# EAGLE design Brushless_2015RevA1_OptEnc (EAGLE 6.2)

## Sheet 1 of 3
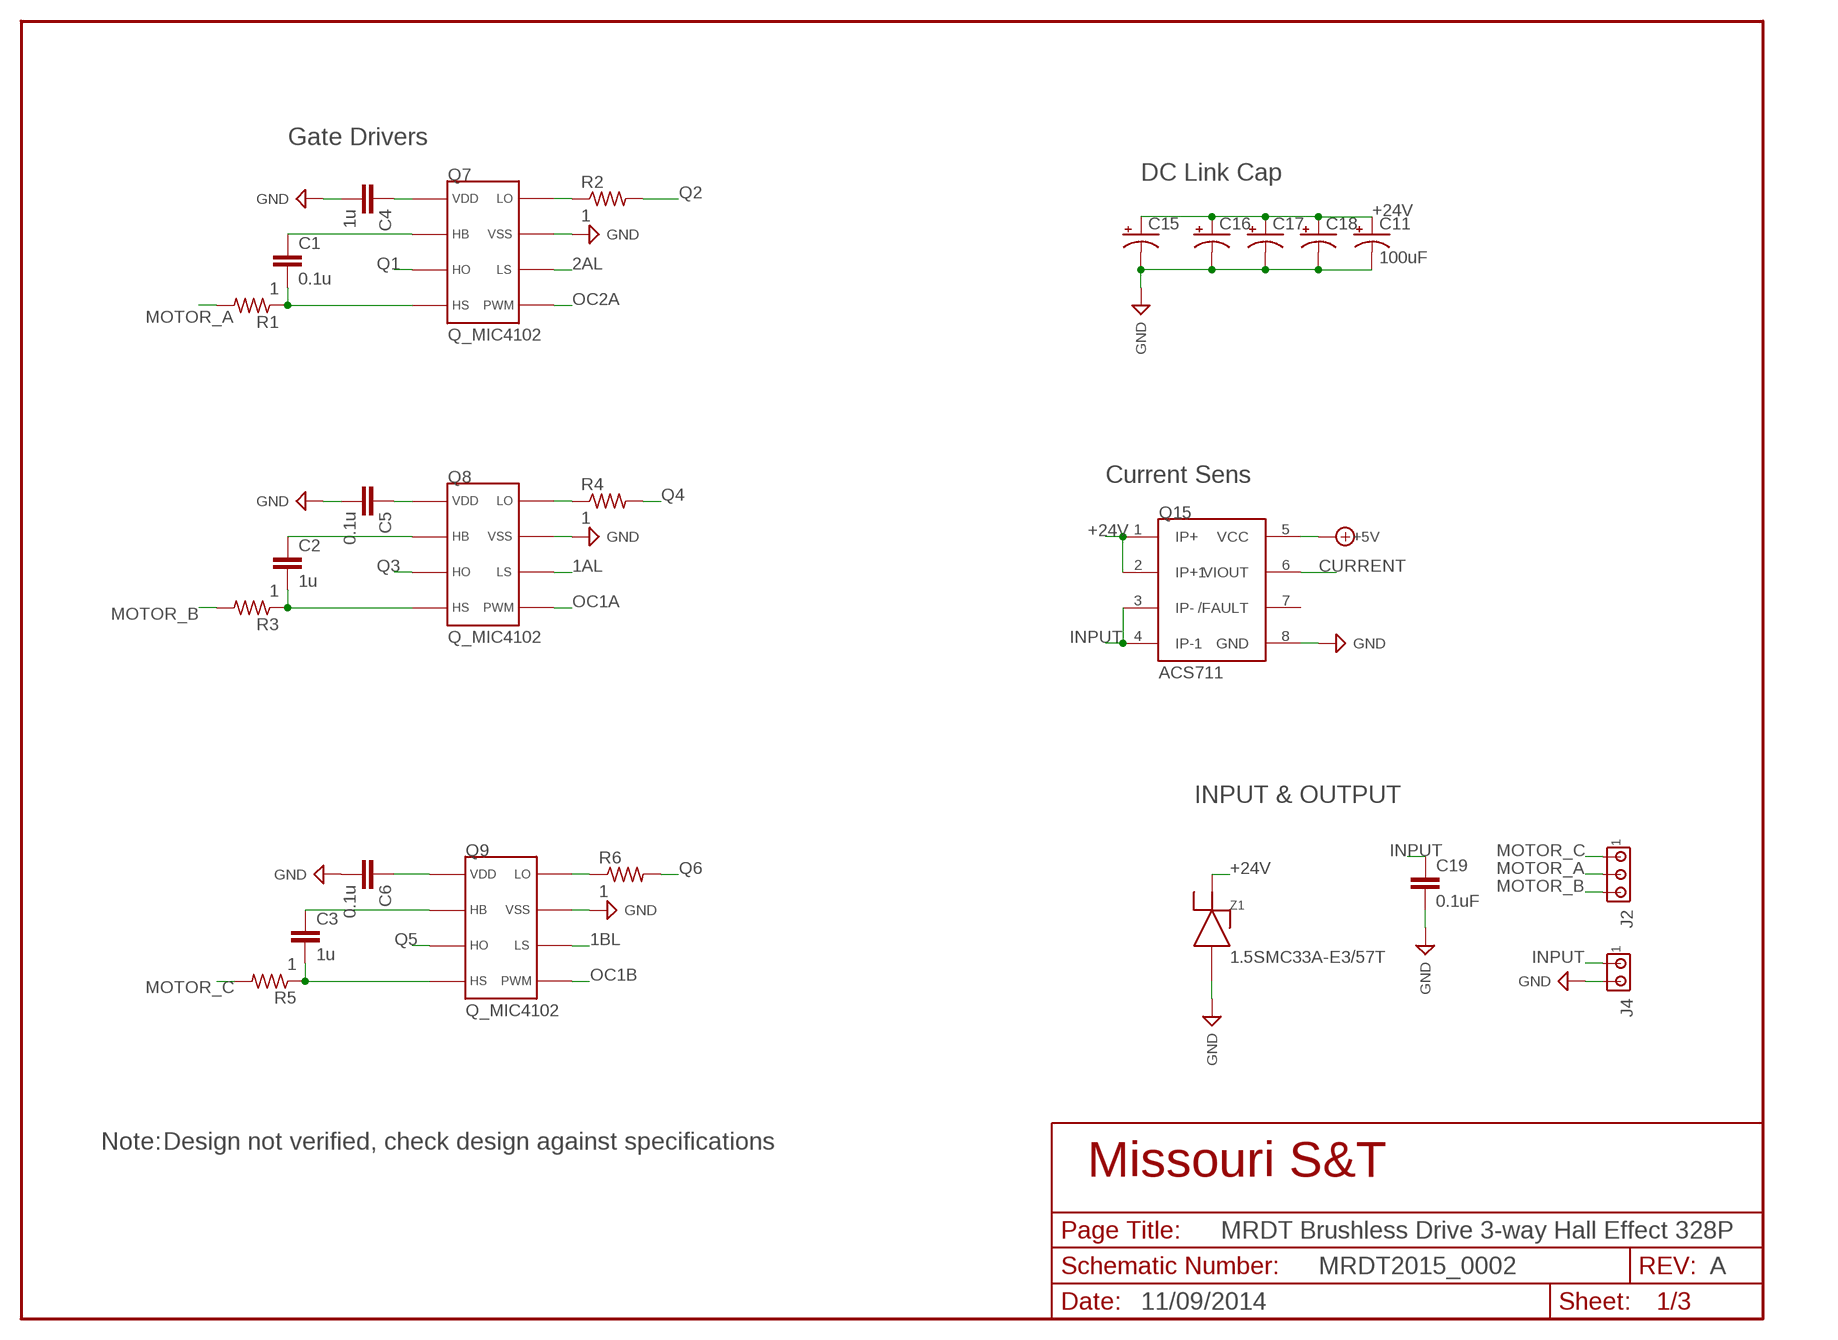
[diagram p0: schematic, sheet 1]

### Parts
C1  0.1u  C_CAP_1206  [C_1206]
C2  1u  C_CAP_1206  [C_1206]
C3  1u  C_CAP_1206  [C_1206]
C4  1u  C_CAP_1206  [C_1206]
C5  0.1u  C_CAP_1206  [C_1206]
C6  0.1u  C_CAP_1206  [C_1206]
C11  100uF  CAP_POL8MM  [C_8MM]
C15  CAP_POL8MM  [C_8MM]
C16  CAP_POL8MM  [C_8MM]
C17  CAP_POL8MM  [C_8MM]
C18  CAP_POL8MM  [C_8MM]
C19  0.1uF  C_CAP_1206  [C_1206]
J2  J_MTA3P_156  [J_MTA156_3P]
J4  J_HDR1X2_MTA_156MIL  [J_MTA1X2_156MIL]
Q7  Q_MIC4102  [SOIC8]
Q8  Q_MIC4102  [SOIC8]
Q9  Q_MIC4102  [SOIC8]
Q15  ACS711  ACS711SOIC  [SOIC8]
R1  1  R_RES_0805  [R_0805]
R2  1  R_RES_0805  [R_0805]
R3  1  R_RES_0805  [R_0805]
R4  1  R_RES_0805  [R_0805]
R5  1  R_RES_0805  [R_0805]
R6  1  R_RES_0805  [R_0805]
Z1  Z_TVSDO214  [DO-214AC]

### Nets
1AL: Q8.6(LS) ; also sheet 2
1BL: Q9.6(LS) ; also sheet 2
2AL: Q7.6(LS) ; also sheet 2
+5V: Q15.5(VCC) ; supply symbol labelled SUP_+5V ; also sheet 2
+12V: C4.1 C5.1 C6.1 Q7.1(VDD) Q8.1(VDD) Q9.1(VDD) ; also sheet 2
+24V: C11.+ C15.+ C16.+ C17.+ C18.+ Q15.1(IP+) Q15.2(IP+1) Z1.C ; also sheet 2,3
CURRENT: Q15.6(VIOUT) ; also sheet 2
GND: C4.2 C5.2 C6.2 C11.- C15.- C16.- C17.- C18.- C19.2 J4.2 Q7.7(VSS) Q8.7(VSS) Q9.7(VSS) Q15.8(GND) Z1.A ; supply symbol labelled SUP_GND ; also sheet 2,3
INPUT: C19.1 J4.1 Q15.3(IP-) Q15.4(IP-1)
MOTOR_A: J2.2 R1.2 ; also sheet 3
MOTOR_B: J2.3 R3.2 ; also sheet 3
MOTOR_C: J2.1 R5.2 ; also sheet 3
N$1: Q7.8(LO) R2.1
N$2: Q8.8(LO) R4.1
N$3: Q9.8(LO) R6.1
N$4: C3.1 Q9.2(HB)
N$5: C3.2 Q9.4(HS) R5.1
N$6: C2.1 Q8.2(HB)
N$8: C2.2 Q8.4(HS) R3.1
N$9: C1.1 Q7.2(HB)
N$10: C1.2 Q7.4(HS) R1.1
OC1A: Q8.5(PWM) ; also sheet 2
OC1B: Q9.5(PWM) ; also sheet 2
OC2A: Q7.5(PWM) ; also sheet 2
Q1: Q7.3(HO) ; also sheet 3
Q2: R2.2 ; also sheet 3
Q3: Q8.3(HO) ; also sheet 3
Q4: R4.2 ; also sheet 3
Q5: Q9.3(HO) ; also sheet 3
Q6: R6.2 ; also sheet 3
Unconnected: Q15.7(/FAULT)

### Notes on the sheet
- Gate Drivers
- DC Link Cap
- Current Sens
- INPUT & OUTPUT
- 1.5SMC33A-E3/57T
- Note: | Design not verified, check design against specifications
- MRDT Brushless Drive 3-way Hall Effect 328P
- MRDT2015_0002 | A
- 11/09/2014

## Sheet 2 of 3
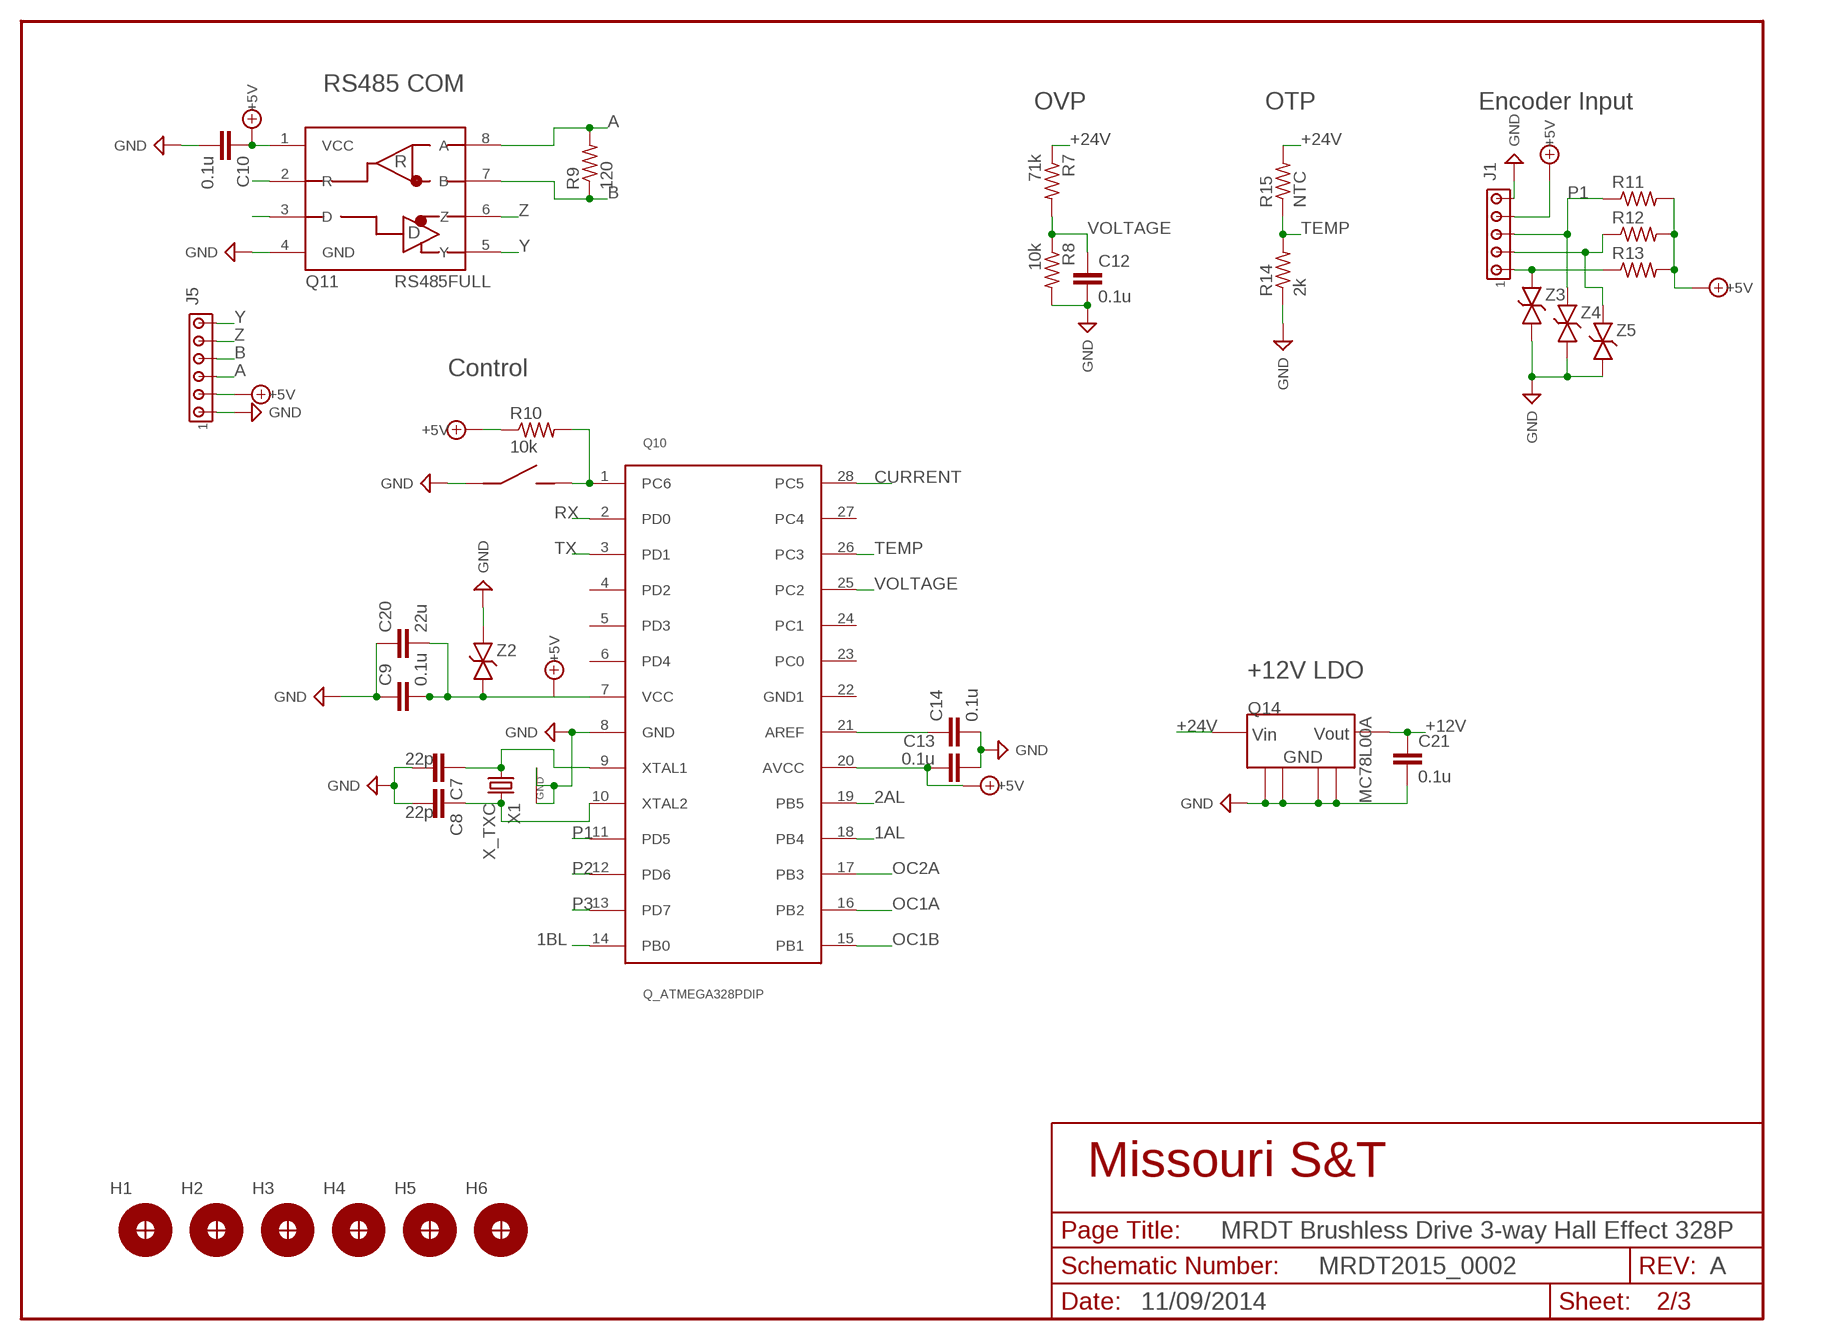
[diagram p1: schematic, sheet 2]

### Parts
C7  22p  C_CAP_1206  [C_1206]
C8  22p  C_CAP_1206  [C_1206]
C9  0.1u  C_CAP_0805  [C_0805]
C10  0.1u  C_CAP_0805  [C_0805]
C12  0.1u  C_CAP_0805  [C_0805]
C13  0.1u  C_CAP_0805  [C_0805]
C14  0.1u  C_CAP_0805  [C_0805]
C20  22u  C_CAP_1206  [C_1206]
C21  0.1u  C_CAP_0805  [C_0805]
H1  H_MNTHOLE_#4  [H_MNTHOLE_#4]
H2  H_MNTHOLE_#4  [H_MNTHOLE_#4]
H3  H_MNTHOLE_#4  [H_MNTHOLE_#4]
H4  H_MNTHOLE_#4  [H_MNTHOLE_#4]
H5  H_MNTHOLE_#4  [H_MNTHOLE_#4]
H6  H_MNTHOLE_#4  [H_MNTHOLE_#4]
J1  J_MTA5P_100  [J_MTA100_5P]
J3  J_MC32857  [J_TOGGLE]
J5  J_HDR1X6_MTA_100MIL  [J_MTA1X6_100MIL]
Q10  Q_ATMEGA328PDIP  [DIP28]
Q11  RS485FULL  [SOIC8]
Q14  MC78L00A  Q_LDOSOIC  [SOIC8]
R7  71k  R_RES_0805  [R_0805]
R8  10k  R_RES_0805  [R_0805]
R9  120  R_RES_0805  [R_0805]
R10  10k  R_RES_0805  [R_0805]
R11  R_RES_1206  [R_1206]
R12  R_RES_1206  [R_1206]
R13  R_RES_1206  [R_1206]
R14  2k  R_RES_0805  [R_0805]
R15  NTC  R_RES_0805  [R_0805]
X1  X_TXC  [SMD_CRYSTAL]
Z2  Z_ESD0603  [0603]
Z3  Z_ESD0603  [0603]
Z4  Z_ESD0603  [0603]
Z5  Z_ESD0603  [0603]

### Nets
1AL: Q10.18(PB4) ; also sheet 1
1BL: Q10.14(PB0) ; also sheet 1
2AL: Q10.19(PB5) ; also sheet 1
+5V: C9.2 C10.1 C13.1 C20.2 J1.4 J5.2 Q10.7(VCC) Q10.20(AVCC) Q11.1(VCC) R10.1 R11.2 R12.2 R13.2 Z2.1 ; supply symbol labelled SUP_+5V ; also sheet 1
+12V: C21.1 Q14.1(VOUT) ; also sheet 1
+24V: Q14.8(VIN) R7.1 R15.2 ; also sheet 1,3
A: J5.3 Q11.8(A) R9.2
B: J5.4 Q11.7(B) R9.1
CURRENT: Q10.28(PC5) ; also sheet 1
GND: C7.2 C8.2 C9.1 C10.2 C12.2 C13.2 C14.2 C20.1 C21.2 J1.5 J3.P$1 J5.1 Q10.8(GND) Q11.4(GND) Q14.2(GND) Q14.3(GND1) Q14.6(GND3) Q14.7(GND2) R8.2 R14.1 X1.2(GND1) X1.4(GND2) Z2.2 Z3.1 Z4.1 Z5.1 ; supply symbol labelled SUP_GND ; also sheet 1,3
N$7: J3.P$2 Q10.1(PC6) R10.2
N$11: C7.1 Q10.9(XTAL1) X1.1
N$13: C8.1 Q10.10(XTAL2) X1.3
N$15: C14.1 Q10.21(AREF)
OC1A: Q10.16(PB2) ; also sheet 1
OC1B: Q10.15(PB1) ; also sheet 1
OC2A: Q10.17(PB3) ; also sheet 1
P1: J1.3 Q10.11(PD5) R11.1 Z4.2
P2: J1.2 Q10.12(PD6) R12.1 Z5.2
P3: J1.1 Q10.13(PD7) R13.1 Z3.2
RX: Q10.2(PD0) Q11.2(R)
TEMP: Q10.26(PC3) R14.2 R15.1
TX: Q10.3(PD1) Q11.3(D)
VOLTAGE: C12.1 Q10.25(PC2) R7.2 R8.1
Y: J5.6 Q11.5(Y)
Z: J5.5 Q11.6(Z)
Unconnected: H1.1 H2.1 H3.1 H4.1 H5.1 H6.1 Q10.4(PD2) Q10.5(PD3) Q10.6(PD4) Q10.22(GND1) Q10.23(PC0) Q10.24(PC1) Q10.27(PC4)

### Notes on the sheet
- RS485 COM
- OVP | OTP | Encoder Input
- Control
- +12V LDO
- MRDT Brushless Drive 3-way Hall Effect 328P
- MRDT2015_0002 | A
- 11/09/2014

## Sheet 3 of 3
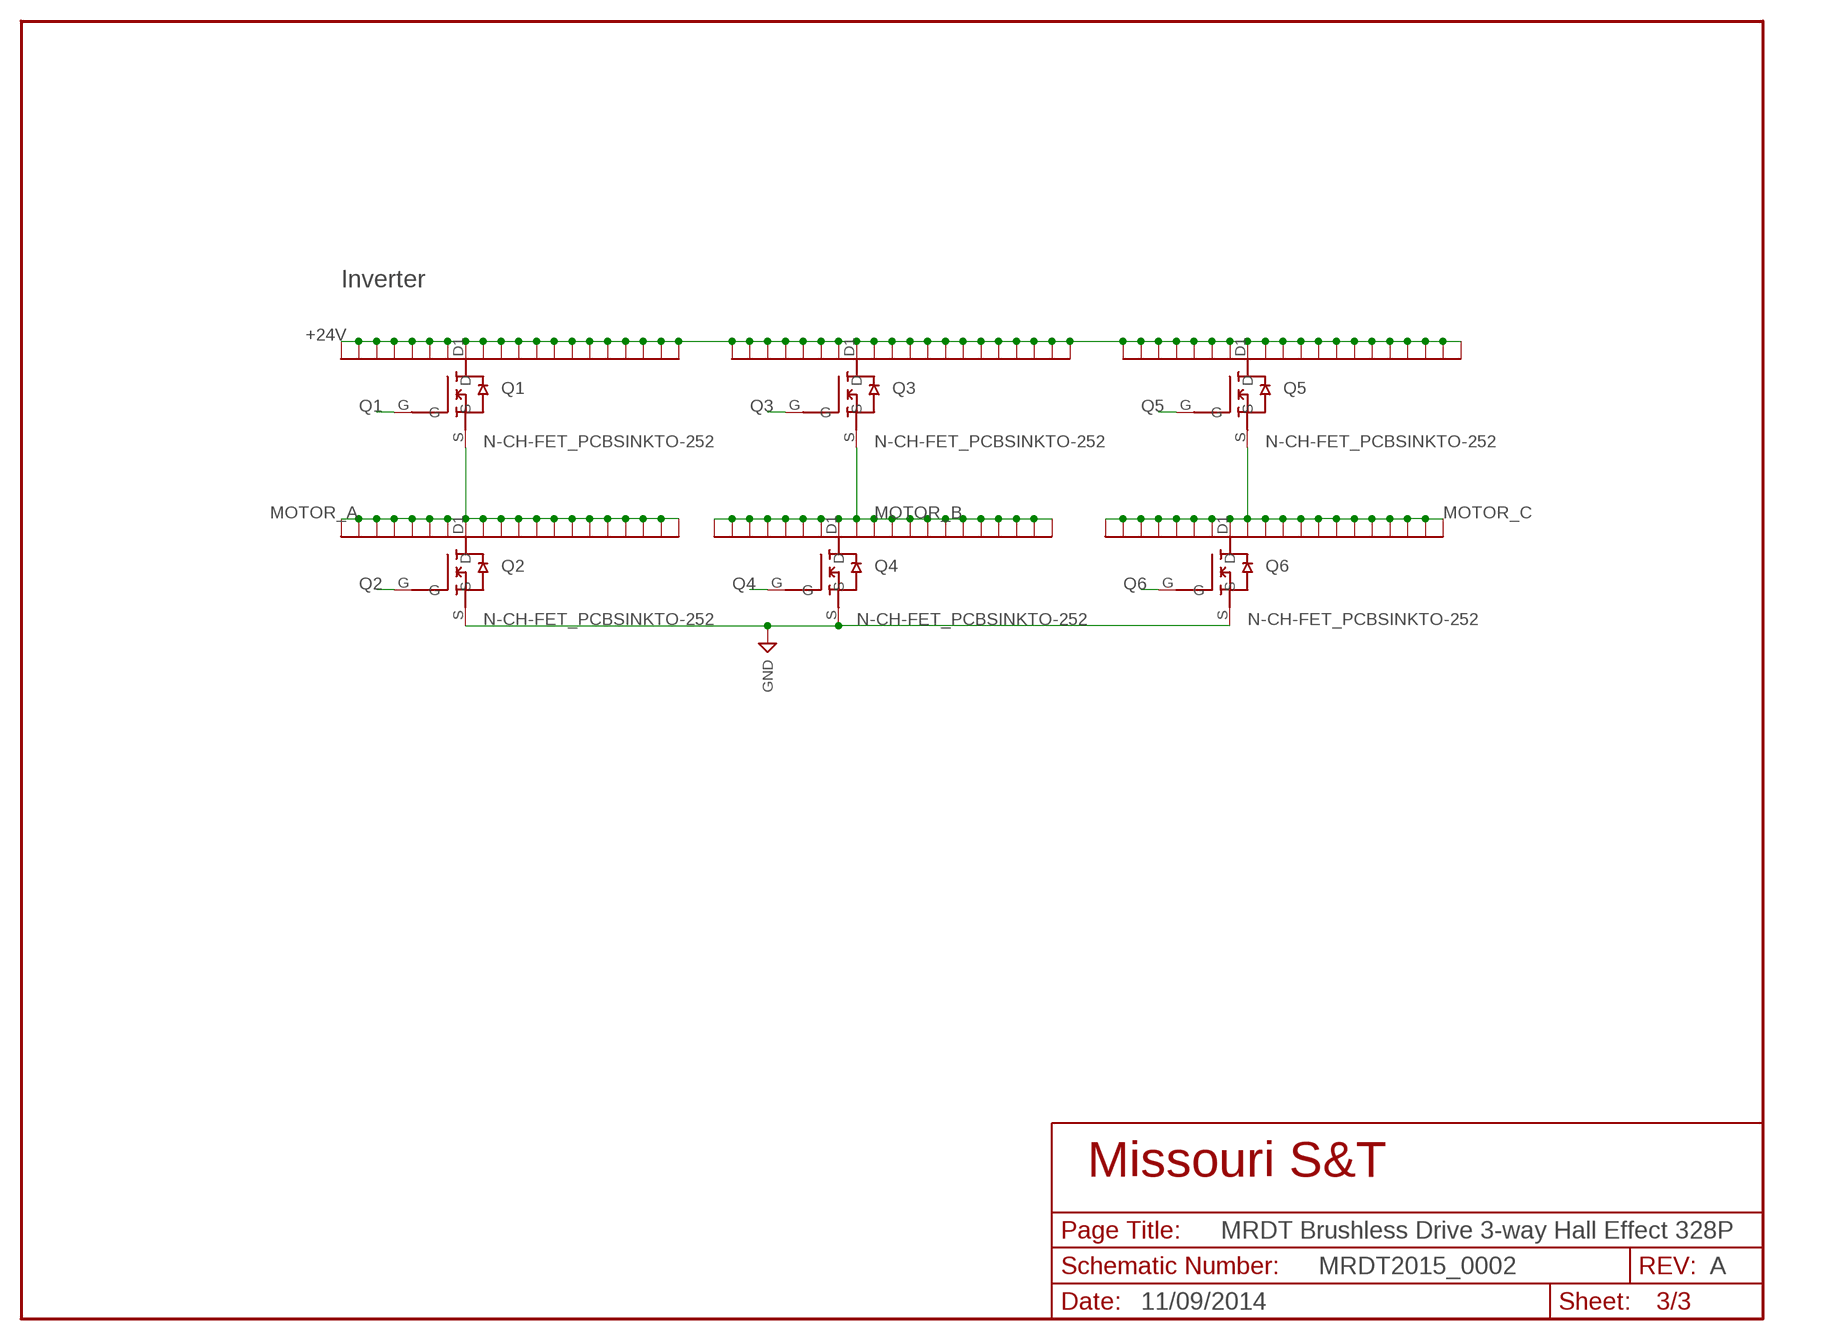
[diagram p2: schematic, sheet 3]

### Parts
Q1  N-CH-FET_PCBSINKTO-252  [TO-252-SINK]
Q2  N-CH-FET_PCBSINKTO-252  [TO-252-SINK]
Q3  N-CH-FET_PCBSINKTO-252  [TO-252-SINK]
Q4  N-CH-FET_PCBSINKTO-252  [TO-252-SINK]
Q5  N-CH-FET_PCBSINKTO-252  [TO-252-SINK]
Q6  N-CH-FET_PCBSINKTO-252  [TO-252-SINK]

### Nets
+24V: Q1.D1(D) Q1.D2 Q1.D3 Q1.D4 Q1.D5 Q1.D6 Q1.D7 Q1.D8 Q1.D9 Q1.D10 Q1.D11 Q1.D12 Q1.D13 Q1.D14 Q1.D15 Q1.D16 Q1.D17 Q1.D18 Q1.D19 Q1.D20 Q3.D1(D) Q3.D2 Q3.D3 Q3.D4 Q3.D5 Q3.D6 Q3.D7 Q3.D8 Q3.D9 Q3.D10 Q3.D11 Q3.D12 Q3.D13 Q3.D14 Q3.D15 Q3.D16 Q3.D17 Q3.D18 Q3.D19 Q3.D20 Q5.D1(D) Q5.D2 Q5.D3 Q5.D4 Q5.D5 Q5.D6 Q5.D7 Q5.D8 Q5.D9 Q5.D10 Q5.D11 Q5.D12 Q5.D13 Q5.D14 Q5.D15 Q5.D16 Q5.D17 Q5.D18 Q5.D19 Q5.D20 ; also sheet 1,2
GND: Q2.S Q4.S Q6.S ; supply symbol labelled SUP_GND ; also sheet 1,2
MOTOR_A: Q1.S Q2.D1(D) Q2.D2 Q2.D3 Q2.D4 Q2.D5 Q2.D6 Q2.D7 Q2.D8 Q2.D9 Q2.D10 Q2.D11 Q2.D12 Q2.D13 Q2.D14 Q2.D15 Q2.D16 Q2.D17 Q2.D18 Q2.D19 Q2.D20 ; also sheet 1
MOTOR_B: Q3.S Q4.D1(D) Q4.D2 Q4.D3 Q4.D4 Q4.D5 Q4.D6 Q4.D7 Q4.D8 Q4.D9 Q4.D10 Q4.D11 Q4.D12 Q4.D13 Q4.D14 Q4.D15 Q4.D16 Q4.D17 Q4.D18 Q4.D19 Q4.D20 ; also sheet 1
MOTOR_C: Q5.S Q6.D1(D) Q6.D2 Q6.D3 Q6.D4 Q6.D5 Q6.D6 Q6.D7 Q6.D8 Q6.D9 Q6.D10 Q6.D11 Q6.D12 Q6.D13 Q6.D14 Q6.D15 Q6.D16 Q6.D17 Q6.D18 Q6.D19 Q6.D20 ; also sheet 1
Q1: Q1.G ; also sheet 1
Q2: Q2.G ; also sheet 1
Q3: Q3.G ; also sheet 1
Q4: Q4.G ; also sheet 1
Q5: Q5.G ; also sheet 1
Q6: Q6.G ; also sheet 1

### Notes on the sheet
- Inverter
- MRDT Brushless Drive 3-way Hall Effect 328P
- MRDT2015_0002 | A
- 11/09/2014

## Library data of the parts
C1-C10 C12-C14 C21 = Master:C_CAP
C11 C15-C18 = Master:CAP_POL: Generic Polarized Capacitor
C19 C20 = Lib_Passive:C_CAP
H1-H6 = Lib_TH:H_MNTHOLE
J1 = Lib_TH:J_MTA5P
J2 = Lib_TH:J_MTA3P
J3 = Master:J_MC32857: SWITCH, TACTILE, SPST-NO, 50mA, THD
J4 = Lib_Electromechanical:J_HDR1X2
J5 = Lib_Electromechanical:J_HDR1X6: AMP connector
Q1-Q6 = Master:N-CH-FET_PCBSINK
Q7-Q9 = Master:Q_MIC4102
Q10 = Master:Q_ATMEGA328P: ATMEGA 328P
Q11 = Master:RS485FULL: Generic Full-Duplex RS485 Transciever, compatible with ADM485x series and MAX308x
Q14 = Master:Q_LDOSOIC
Q15 = Master:ACS711: Hall Effect Current Sensor
R1-R9 = Master:R_RES
R10-R15 = Lib_Passive:R_RES
X1 = Master:X_TXC
Z1 = Master:Z_TVS: Generic TVS Diode
Z2-Z5 = Master:Z_ESD

## Board
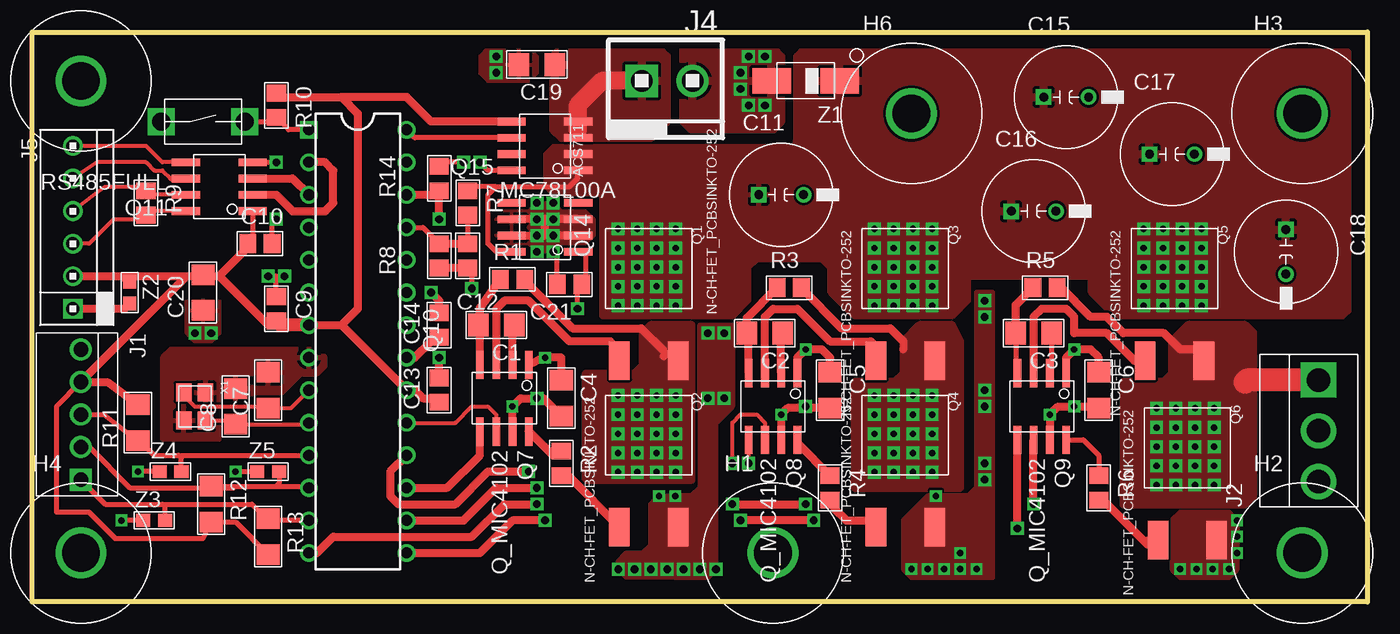
[diagram p3: board, top side]
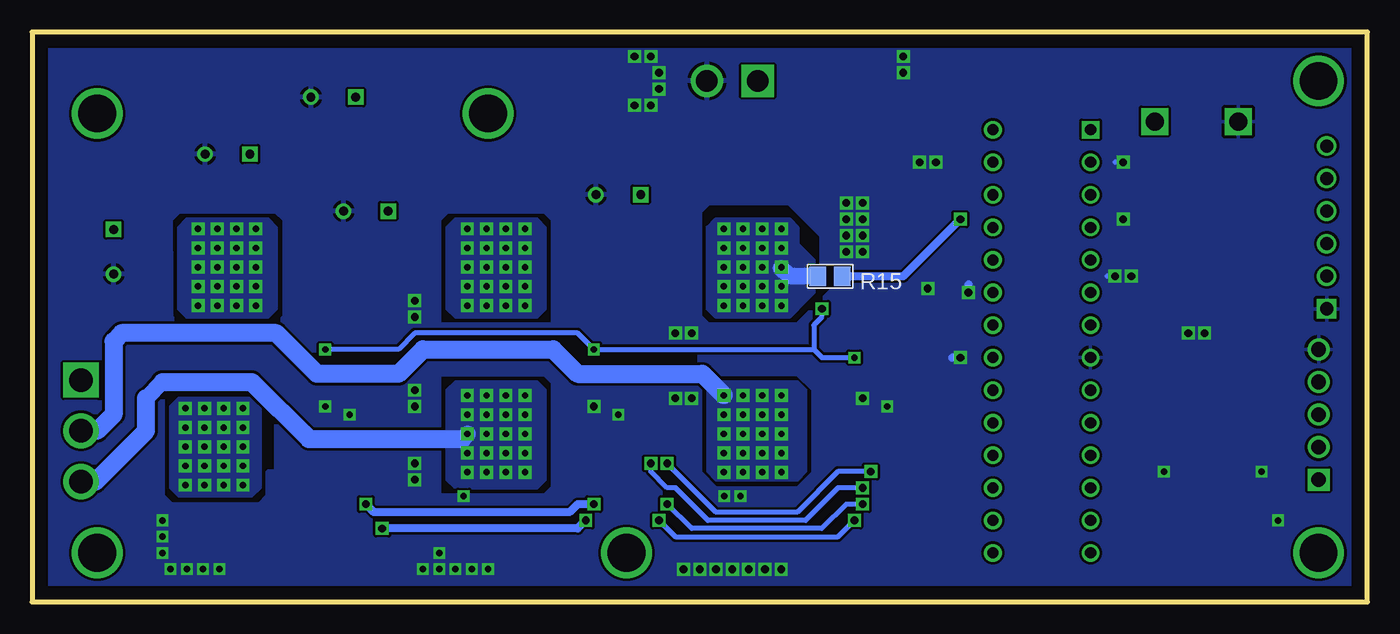
[diagram p4: board, bottom side, seen from below]

Size 104.14 x 44.45 mm. Coordinates in mm from the lower left corner, seen from the top.
Outline: 0,0 0,44.45 104.14,44.45 104.14,0 0,0
Copper layers (1*16): Top 0.035mm / dielectric 1.5mm / Bottom 0.035mm
Design rules: minimum track width 10mil, minimum drill 15mil, track to track 8mil, track to pad 8mil, pad to pad 8mil, via to via 8mil, smd to smd 8mil, copper to edge 40mil, drill to drill 8mil, minimum pad ring 10mil, minimum via ring 8mil, stop-mask expansion 0mil, vias tented up to drill 0mil, thermal gap 10mil

### Footprints (pad centres in the part's own frame; a part is rotated, then mirrored left to right if it is on the bottom)
C_1206 = smd 1.6 x 1.8: 1 -1.4,0; 2 1.4,0
C_0805 = smd 1.3 x 1.5: 1 -0.95,0; 2 0.95,0
C_8MM = drill 0.7 square: + -1.75,0 | drill 0.7: - 1.75,0
H_MNTHOLE_#4 = drill 2.946: 1 0,0
J_MTA100_5P = drill 1.143 square: 1 5.08,0 | drill 1.143: 2 2.54,0; 3 0,0; 4 -2.54,0; 5 -5.08,0
J_MTA156_3P = drill 1.829 square: 1 3.962,0 | drill 1.829: 2 0,0; 3 -3.962,0
J_TOGGLE = drill 1.4 square: P$1 -3.25,0; P$2 3.25,0
J_MTA1X2_156MIL = drill 1.676 square: 1 1.981,0 | drill 1.676: 2 -1.981,0
J_MTA1X6_100MIL = drill 1.016 square: 1 6.35,0 | drill 1.016: 2 3.81,0; 3 1.27,0; 4 -1.27,0; 5 -3.81,0; 6 -6.35,0
TO-252-SINK = drill 0.5 square: D1 -3.1,2.1; D2 -3.1,0.6; D3 -3.1,-0.9; D4 -3.1,-2.4; D5 -1.6,-2.4; D6 -1.6,-0.9; D7 -1.6,0.6; D8 -1.6,2.1; D9 -0.1,2.1; D10 -0.1,0.6; D11 -0.1,-0.9; D12 -0.1,-2.4; D13 1.4,-2.4; D14 1.4,-0.9; D15 1.4,0.6; D16 1.4,2.1; D17 2.9,-2.4; D18 2.9,-0.9; D19 2.9,0.6; D20 2.9,2.1 | smd 3 x 1.6: G 7.18,-2.285; S 7.18,2.285
SOIC8 = smd 2.2 x 0.6: 1 -2.6,1.905; 2 -2.6,0.635; 3 -2.6,-0.635; 4 -2.6,-1.905; 5 2.6,-1.905; 6 2.6,-0.635; 7 2.6,0.635; 8 2.6,1.905
DIP28 = drill 0.864 square: 1 -16.51,-3.81 | drill 0.864: 2 -13.97,-3.81; 3 -11.43,-3.81; 4 -8.89,-3.81; 5 -6.35,-3.81; 6 -3.81,-3.81; 7 -1.27,-3.81; 8 1.27,-3.81; 9 3.81,-3.81; 10 6.35,-3.81; 11 8.89,-3.81; 12 11.43,-3.81; 13 13.97,-3.81; 14 16.51,-3.81; 15 16.51,3.81; 16 13.97,3.81; 17 11.43,3.81; 18 8.89,3.81; 19 6.35,3.81; 20 3.81,3.81; 21 1.27,3.81; 22 -1.27,3.81; 23 -3.81,3.81; 24 -6.35,3.81; 25 -8.89,3.81; 26 -11.43,3.81; 27 -13.97,3.81; 28 -16.51,3.81
R_0805 = smd 1.3 x 1.5: 1 -0.95,0; 2 0.95,0
R_1206 = smd 1.6 x 1.8: 1 -1.4,0; 2 1.4,0
SMD_CRYSTAL = smd 1.4 x 1.2: 1 -1.1,-0.865; 2 1.1,-0.865; 3 1.1,0.835; 4 -1.1,0.835
DO-214AC = smd 3 x 2: A 2.65,0; C -2.65,0
0603 = smd 1.1 x 1: 1 -0.85,0; 2 0.85,0

### Placement (x,y rotation side)
C1  36.2,21.59 180 top
C2  57.15,20.95 180 top
C3  78.11,20.95 180 top
C4  41.27,15.88 270 top
C5  62.23,16.51 270 top
C6  83.19,16.51 270 top
C7  18.41,16.51 90 top
C8  15.88,15.24 90 top
C9  19.05,22.86 270 top
C10  17.78,27.94 0 top
C11  58.42,31.75 0 top
C12  33.97,26.99 270 top
C13  31.75,16.51 90 top
C14  31.75,21.59 90 top
C15  80.64,39.37 0 top
C16  78.11,30.48 0 top
C17  88.9,34.92 0 top
C18  97.79,27.3 270 top
C19  39.37,41.91 180 top
C20  13.34,24.13 90 top
C21  41.91,24.77 180 top
H1  57.78,3.81 0 top
H2  99.06,3.81 0 top
H3  99.06,38.1 0 top
H4  3.81,3.81 0 top
H5  3.81,40.64 0 top
H6  68.58,38.1 0 top
J1  3.81,14.61 270 top
J2  100.33,13.34 90 top
J3  13.34,37.47 0 top
J4  49.53,40.64 180 top
J5  3.17,29.21 270 top
Q1  48.09,26 270 top
Q2  48.09,13 270 top
Q3  68.09,26 270 top
Q4  68.09,13 270 top
Q5  89.09,26 270 top
Q6  90.09,12 270 top
Q7  36.83,15.88 270 top
Q8  57.78,15.24 270 top
Q9  78.74,15.24 270 top
Q10  25.4,20.32 270 top
Q11  14.61,32.38 180 top
Q14  40.01,29.21 180 top
Q15  40.01,35.56 180 top
R1  37.47,25.15 0 top
R2  41.27,10.79 270 top
R3  59.05,24.51 0 top
R4  62.23,8.89 270 top
R5  78.99,24.51 0 top
R6  83.19,8.89 270 top
R7  33.97,31.11 270 top
R8  31.75,26.99 270 top
R9  8.89,31.11 270 top
R10  19.05,38.73 270 top
R11  8.26,13.97 90 top
R12  13.97,7.62 270 top
R13  18.41,5.08 270 top
R14  31.75,33.02 270 top
R15  41.91,25.4 180 bottom
X1  12.7,15.24 270 top
Z1  60.33,40.64 180 top
Z2  7.62,24.13 270 top
Z3  9.53,6.35 0 top
Z4  10.79,10.16 0 top
Z5  18.41,10.16 0 top

### Tracks (layer width: path | path; a pad name or v marks a point on that pad's centre or on a via)
1AL  (via drill 0.6)
  Top 0.305: v54.61,10.79 54.61,13.97 55.24,14.61 56.52,14.61 57.15,13.97 Q8.6
  Top 0.61: Q10.18 27.94,10.16 27.94,8.26 28.57,7.62 33.02,7.62 35.56,10.16 v38.73,10.16
  Bottom 0.406: v38.73,10.16 41.27,10.16 44.45,6.99 50.8,6.99 v54.61,10.79
1BL  (via drill 0.6)
  Top 0.61: Q10.14 22.23,3.81 23.5,5.08 34.29,5.08 36.83,7.62 v39.37,7.62 | v54.61,7.62 v60.33,7.62 | v78.11,7.62 Q9.6
  Bottom 0.406: v39.37,7.62 40.64,7.62 42.55,5.71 52.7,5.71 v54.61,7.62
  Bottom 0.61: v60.33,7.62 61.59,7.62 62.23,6.99 77.47,6.99 v78.11,7.62
2AL
  Top 0.305: Q10.19 33.02,13.97 34.29,15.24 35.56,15.24 36.2,14.61 Q7.6
+5V
  Top 0.305: C20.2 13.34,25.4
  Top 0.406: C10.1 17.2,28.32 Q11.1 | J1.4 1.91,15.24 1.91,6.99 4.45,6.99 6.48,4.95 13.34,4.95 R12.2 15.88,6.22 R13.2 | Q15.5 36.2,37.47
  Top 0.61: C13.1 31.43,15.88 30.48,15.88 29.84,16.51 Q10.20 24.13,21.59 | 36.2,37.47 31.11,37.47 29.21,39.37 24.13,39.37 | R10.1 19.36,39.37 24.13,39.37 | Q10.7 24.13,21.59 | 24.13,39.37 25.4,38.1 25.4,22.86 24.13,21.59 | 12.06,25.4 6.99,25.4 Z2.1 7.2,25.4 J5.2 | 12.06,25.4 13.34,25.4 14.61,25.4 | 14.61,25.4 18.41,21.59 18.73,21.59 C9.2 | C10.1 16.83,27.62 14.61,25.4 | 12.06,25.4 J1.4 5.84,17.14 R11.2
  Top 1.016: Q10.7 19.37,21.59 C9.2
+12V  (via drill 0.5, 0.6)
  Top 0.406: 43.18,27.3 43.18,25.09 C21.1 42.55,24.45 v42.55,22.86
  Top 0.61: v81.28,19.68 81.41,19.68 | Q9.1 80.64,19.05 v81.28,19.68 | C6.1 83.19,19.05 82.55,19.68 v81.28,19.68 | Q8.1 59.69,19.05 v60.33,19.68 61.59,19.68 62.23,19.05 C5.1 | Q7.1 39.95,19.11 v40.01,19.05 41.27,19.05 C4.1 | Q14.1 43.18,27.3
  Bottom 0.406: v81.28,19.68 75.56,19.68 74.3,20.95 61.59,20.95 v60.33,19.68 43.18,19.68 | 43.18,19.68 43.18,21.59 42.55,22.23 v42.55,22.86 | 43.18,19.68 42.55,19.05 v40.01,19.05
+24V
  Top 0.406: Q14.8 36.2,27.3 35.56,27.94 35.56,31.75 36.2,32.38 | 36.2,32.38 41.91,32.38 42.55,33.02 42.55,33.59 Q15.1 | 36.2,32.38 34.29,32.38 R7.1
  Bottom 1.27: R15.2 45.09,25.4 45.72,26.04
  pour Top: 54.61,22.23 44.45,22.23 44.45,34.29 45.72,35.56 101.6,35.56 102.23,34.92 102.87,22.86 102.23,22.23 84.45,22.23 82.55,24.13 82.55,26.04 81.92,26.67 73.66,26.67 73.03,26.04 73.03,23.5 71.75,22.23 64.14,22.23 62.23,24.13 62.23,26.04 61.59,26.67 56.52,26.67 55.88,26.04 55.88,23.5
  pour Top: 45.72,35.56 40.64,35.56 40.01,34.92 40.01,32.38 40.64,31.75 44.45,31.75 45.09,31.11 45.72,31.11
  pour Top: 59.05,29.21 59.69,36.2 59.69,42.55 60.33,43.18 102.23,43.18 102.87,42.55 102.87,25.4 66.67,25.4 62.87,29.21
  pour Bottom: 50.8,22.23 51.44,22.86 51.44,29.21 50.8,29.84 45.09,29.84 44.45,29.21 44.45,22.86 45.09,22.23
  pour Bottom: 64.77,29.84 71.12,29.84 71.75,29.21 71.75,22.86 71.12,22.23 64.77,22.23 64.14,22.86 64.14,29.21
  pour Bottom: 85.72,29.84 85.09,29.21 85.09,22.86 85.72,22.23 92.08,22.23 92.71,22.86 92.71,29.21 92.08,29.84
  pour Bottom: 44.45,27.94 43.18,26.67 43.18,24.13 44.45,22.86 45.72,22.86 45.72,27.3
A
  Top 0.305: Q11.8 8.57,30.48 R9.2 | 8.57,29.84 6.35,29.84 4.45,27.94 J5.3
  Top 0.406: 8.57,29.84 R9.2
B
  Top 0.305: Q11.7 9.21,31.75 R9.1 | 8.57,32.38 5.71,32.38 J5.4
  Top 0.406: 8.57,32.38 R9.1
CURRENT
  Top 0.406: Q15.6 29.84,36.2 Q10.28
GND  (via drill 0.5, 0.6)
  Top 0.406: 19.05,28.26 C10.2 18.73,29.52 v19.05,29.84 | Q11.4 v19.05,34.29 | C9.1 19.05,25.4 | 19.05,25.4 v18.41,25.4 | 19.05,25.4 v19.68,25.4 | R8.2 34.29,26.04 v34.29,24.45 | Q15.8 35.56,33.66 v34.92,34.29 | v33.66,34.29 32.07,34.29 R14.1 | v15.88,10.16 Z5.1 | Z4.1 v8.26,10.16 | Z3.1 v6.99,6.35 | C21.2 40.96,26.98 v40.64,27.3
  Top 0.61: C6.2 83.06,15.24 v81.28,15.24 80.01,15.24 v79.38,14.61 Q9.7 | C12.2 R8.2 | C13.2 v31.75,19.05 | C14.2 31.75,23.5 v31.11,24.13 | C5.2 60.33,15.11 | 60.33,15.11 58.92,15.11 v58.42,14.61 Q8.7 | v60.33,15.24 60.33,15.11 | Q7.7 v37.47,15.24 38.1,15.88 v39.37,15.88 39.88,15.88 C4.2 | Q14.7 v39.37,28.57 40.01,28.57 | Q14.3 v40.64,29.84 40.01,29.84 | 40.01,29.84 v39.37,29.84 Q14.6 | Q14.2 v40.64,28.57 40.01,28.57 | 40.01,28.57 40.01,29.84 | Z2.2 7.2,22.86 J5.1
  Bottom 0.406: v19.05,34.29 19.68,34.29 | v19.68,25.4 20.32,25.4
  Bottom 0.61: v31.75,19.05 32.38,19.05 | v31.11,24.13 31.11,24.77
  other vias: 46.99,2.54 48.26,2.54 49.53,2.54 50.8,2.54 68.58,2.54 69.85,2.54 71.12,2.54 72.39,2.54 72.39,3.81 73.66,2.54 89.53,2.54 90.81,2.54 92.08,2.54 93.34,2.54 52.7,20.95 53.98,20.95 52.7,15.88 53.98,15.88 74.3,23.5 74.3,22.23 74.3,16.51 74.3,15.24 74.3,10.79 74.3,9.53 39.37,31.11 40.64,31.11 39.37,27.3 55.88,42.55 57.15,42.55 55.24,41.27 55.24,40.01 55.88,38.73 57.15,38.73 36.2,42.55 36.2,41.27 12.7,20.95 13.97,20.95 45.72,2.54 52.07,2.54 53.34,2.54 48.9,8.26 50.16,8.26 70.48,8.26 93.98,3.81 93.98,5.08 93.98,6.35
  pour Top: 20.95,17.78 22.23,17.78 22.86,18.41 22.86,19.05 22.23,19.68 10.79,19.68 10.16,19.05 10.16,12.7 14.61,12.7 14.61,15.24 15.24,15.88 19.05,15.88
  pour Top: 72.39,6.99 68.58,6.99 67.94,6.35 67.94,2.54 68.58,1.91 72.39,1.91 73.03,2.54 73.03,6.35
  pour Top: 93.34,6.99 89.53,6.99 88.9,6.35 88.9,2.54 89.53,1.91 93.34,1.91 93.98,2.54 93.98,6.35
  pour Top: 52.07,21.59 54.61,21.59 54.61,15.24 52.07,15.24
  pour Top: 74.93,24.13 73.66,24.13 73.66,10.16 74.93,10.16
  pour Top: 73.66,10.16 73.66,8.26 71.75,6.35 71.75,1.91 74.93,1.91 74.93,10.16
  pour Top: 48.9,8.26 51.44,8.26 52.07,7.62 52.07,2.54 51.44,1.91 46.35,1.91 45.72,2.54 45.72,3.17 46.35,3.81 47.62,3.81 48.26,4.45 48.26,7.62
  pour Top: 52.07,17.78 52.07,8.89 51.44,8.26 50.16,8.26 50.16,1.91 52.7,1.91 53.34,2.54 53.34,13.97 54.61,15.24 54.61,17.78
  pour Top: 43.18,30.48 41.27,30.48 40.64,31.11 39.37,31.11 38.73,30.48 36.83,30.48 36.2,29.84 36.2,28.57 36.83,27.94 38.73,27.94 39.37,27.3 40.64,27.3 41.27,27.94 43.18,27.94 43.81,28.57 43.81,29.84
  pour Top: 51.44,43.18 57.78,43.18 58.42,42.55 58.42,37.47 57.78,36.83 51.44,36.83 50.8,37.47 50.8,43.18
  pour Top: 38.73,40.64 39.37,41.27 39.37,42.55 38.73,43.18 35.56,43.18 34.92,42.55 34.92,41.27 35.56,40.64
  pour Top: 13.97,23.5 14.61,23.5 14.61,20.95 13.97,20.32 12.7,20.32 12.06,20.95 12.06,23.5
  pour Bottom: 0,44.45 39.37,44.45 39.37,0 0,0
  pour Bottom: 39.37,44.45 39.37,0 53.98,0 53.98,8.26 43.81,8.26 43.18,8.89 43.18,16.51 44.45,17.78 52.07,17.78 52.07,21.59 44.45,21.59 42.55,23.5 42.55,28.57 45.09,31.11 51.44,31.11 51.44,44.45
  pour Bottom: 39.37,22.23 40.01,21.59 51.44,21.59 52.07,22.23 52.07,30.48 51.44,31.11 51.44,44.45 104.14,44.45 104.14,22.23 93.98,22.23 93.34,22.86 93.34,29.84 92.71,30.48 85.09,30.48 84.45,29.84 84.45,22.23 85.09,21.59 85.09,0 72.39,0 72.39,29.84 71.75,30.48 64.14,30.48 63.5,29.84 63.5,17.14 62.87,16.51 52.7,16.51 51.44,17.78 37.47,17.78 37.47,22.23
  pour Bottom: 104.14,0 104.14,27.3 93.34,27.3 93.34,22.23 92.71,21.59 80.64,21.59 80.64,10.79 85.72,10.79 85.72,15.24 87,16.51 93.34,16.51 93.98,15.88 93.98,8.26 93.34,7.62 86.36,7.62 85.72,8.26 85.72,10.16 81.28,10.16 81.28,0
  pour Bottom: 73.03,0 38.73,0 38.73,24.77 41.27,24.77 44.45,21.59 44.45,18.41 43.18,17.14 43.18,8.89 43.81,8.26 51.44,8.26 52.07,8.89 52.07,17.14 51.44,17.78 45.72,17.78 45.09,18.41 45.09,21.59 73.03,21.59 73.03,17.78 64.14,17.78 63.5,17.14 63.5,8.89 64.14,8.26 73.03,8.26
  pour Bottom: 43.18,8.89 44.45,7.62 50.8,7.62 52.07,8.89 53.98,10.79 53.98,14.61 54.61,15.24 54.61,16.51 52.07,16.51 52.07,10.16 50.8,8.89 44.45,8.89 43.81,9.53 43.18,10.16 43.18,11.43 42.55,11.43 42.55,9.53
  pour Top: 73.66,8.89 73.03,8.26 69.85,8.26 68.58,6.99 68.58,6.35 74.3,6.35 74.3,8.89
INPUT
  Top 0.406: Q15.3 Q15.4 42.55,37.41 42.55,36.83
  Top 1.422: J4.1 44.45,40.64 42.55,38.73 42.55,36.83
  pour Top: 42.55,36.2 48.26,36.2 49.53,37.47 49.53,42.55 48.9,43.18 41.27,43.18 40.64,42.55 40.64,36.83 41.27,36.2
MOTOR_A
  Top 0.61: R1.2 39.05,24.45 42.16,21.34 47.5,21.34 49.28,19.56 49.28,19.16
  Bottom 1.27: J2.2 99.06,13.34
  Bottom 1.422: Q2.D1 51.88,17.78 61.59,17.78 63.5,19.68 73.66,19.68 75.56,17.78 81.92,17.78 85.09,20.95 97.16,20.95 97.79,20.32 97.79,14.61 99.06,13.34
  pour Top: 51.44,9.53 51.44,21.59 48.26,21.59 47.62,20.95 47.62,18.41 46.99,17.78 43.18,17.78 43.18,9.53
  pour Bottom: 44.45,17.14 50.8,17.14 51.44,16.51 51.44,10.16 50.8,9.53 44.45,9.53 43.81,10.16 43.81,16.51
MOTOR_B
  Top 0.61: R3.2 59.94,24.51 63.12,21.34 66.93,21.34 67.94,20.32 67.94,19.68 | 70.48,19.39 70.48,19.56 70.23,19.56
  Bottom 1.27: J2.3 99.21,9.37 | 95.25,15.88 93.98,17.14 | 70.59,12.7 Q4.D9
  Bottom 1.422: 99.21,9.37 95.25,13.34 95.25,15.88 | 93.98,17.14 87,17.14 82.55,12.7 70.59,12.7
  pour Top: 71.75,21.59 69.22,21.59 67.94,20.32 67.94,17.78 67.31,17.14 64.14,17.14 64.14,8.89 72.39,8.89 72.39,20.32
  pour Bottom: 64.77,17.14 71.12,17.14 71.75,16.51 71.75,9.53 71.12,8.89 64.77,8.89 64.14,9.53 64.14,16.51
MOTOR_C
  Top 0.61: 91.19,19.16 91.19,19.68 89.53,19.68 88.27,20.95 85.09,20.95 83.82,22.23 82.55,22.23 80.26,24.51 R5.2
  Top 1.778: J2.1 94.77,17.3 94.61,17.14
  pour Top: 95.25,8.26 95.25,20.95 94.61,21.59 90.17,21.59 88.9,20.32 88.9,17.78 88.27,17.14 85.09,17.14 85.09,7.62 94.61,7.62
  pour Bottom: 92.71,15.88 93.34,15.24 93.34,8.89 92.71,8.26 87,8.26 86.36,8.89 86.36,15.24 87,15.88
N$1
  Top 0.61: Q7.8 38.73,13.34 | 38.73,13.97 38.73,13.34 | 38.73,13.34 40.64,11.43 40.96,11.43 R2.1
N$2
  Top 0.61: Q8.8 59.69,12.38 R4.1
N$3
  Top 0.406: Q9.8 81.97,12.64 83.19,11.43 R6.1
N$4
  Top 0.406: C3.1 79.5,17.97 Q9.2
N$5
  Top 0.406: C3.2 76.7,17.97 Q9.4
  Top 0.61: C3.2 76.7,23.17 R5.1
N$6
  Top 0.61: Q8.2 58.42,20.82 C2.1
N$7
  Top 0.406: J3.P$2 18.73,37.47 R10.2 20,36.83 Q10.1
N$8
  Top 0.61: Q8.4 55.88,20.82 C2.2 55.75,22.16 R3.1
N$9
  Top 0.61: Q7.2 37.47,21.46 C1.1
N$10
  Top 0.61: Q7.4 34.92,21.46 C1.2 34.92,21.72 34.92,22.92 R1.1
N$11
  Top 0.305: X1.1 11.84,16.11 12.7,15.24 18.29,15.24 C7.1 20.19,15.11 Q10.9
N$13
  Top 0.305: X1.3 15.57,14.14 C8.1 21.46,13.84 Q10.10
N$15
  Top 0.61: Q10.21 29.84,19.05 31.11,20.32 31.43,20.32 C14.1
OC1A  (via drill 0.6)
  Top 0.305: Q8.5 v55.88,10.79
  Top 0.61: Q10.16 33.66,6.35 36.2,8.89 v39.37,8.89
  Bottom 0.406: v39.37,8.89 41.27,8.89 43.81,6.35 51.44,6.35 53.98,8.89 54.61,8.89 55.88,10.16 v55.88,10.79
OC1B  (via drill 0.6)
  Top 0.61: Q10.15 34.92,3.81 37.47,6.35 v40.01,6.35 | v60.96,6.35 v55.24,6.35 | v76.83,5.71 Q9.5
  Bottom 0.406: v55.24,6.35 53.98,5.08 41.27,5.08 v40.01,6.35
  Bottom 0.61: v60.96,6.35 61.59,5.71 v76.83,5.71
OC2A
  Top 0.61: Q10.17 32.38,8.89 34.92,11.43 Q7.5
P1
  Top 0.406: J1.3 5.58,14.61 R11.1 9.02,11.94 9.53,11.43 11.43,11.43 | 11.43,11.43 Q10.11 | Z4.2 11.64,11.21 11.43,11.43
P2
  Top 0.406: 19.05,9.02 R12.1 15.74,8.89 7.62,8.89 4.45,12.06 J1.2 | 19.05,9.02 21.46,9.02 Q10.12 | Z5.2 19.27,9.23 19.05,9.02
P3
  Top 0.406: Q10.13 18.55,6.35 R13.1 18.29,6.48 17.14,7.62 10.16,7.62 | J1.1 5.71,7.62 10.16,7.62 | Z3.2 10.38,7.41 10.16,7.62
Q1
  Top 0.61: Q1.G 45.81,19.59 45.09,20.32 41.91,20.32 38.73,23.5 36.83,23.5 36.2,22.86 Q7.3
Q2
  Top 0.61: R2.2 41.78,9.85 Q2.G
Q3
  Top 0.61: Q8.3 57.15,22.23 57.78,22.86 59.69,22.86 62.23,20.32 65.41,20.32 66.04,19.68 66.04,19.05 Q3.G
Q4
  Top 0.61: R4.2 62.55,7.94 62.55,7.3 63.5,6.35 65.28,6.35 Q4.G
Q5
  Top 0.61: Q5.G 85.95,18.82 83.82,20.95 81.28,20.95 81.28,22.23 80.64,22.86 78.74,22.86 78.11,22.23 Q9.3
Q6
  Top 0.406: Q6.G 87.37,4.82 87,4.45
  Top 0.61: R6.2 83.5,7.94 87,4.45 87,4.79
RX
  Top 0.61: Q11.2 19.05,31.75 20.32,30.48 22.86,30.48 23.5,31.11 23.5,33.66 22.86,34.29 Q10.2
TEMP  (via drill 0.6)
  Top 0.61: v31.75,29.84 R14.2 31.43,31.75 Q10.26
  Bottom 0.61: R15.1 36.2,25.4 v31.75,29.84
TX
  Top 0.61: Q11.3 20.32,33.02 Q10.3
VOLTAGE
  Top 0.406: R7.2 C12.1 | Q10.25 30.48,29.21 R8.1
  Top 0.61: R8.1 C12.1
Y
  Top 0.305: Q11.5 10.16,34.29 8.89,35.56 J5.6
Z
  Top 0.305: 10.79,33.02 10.16,33.66 9.53,33.66 8.89,34.29 5.08,34.29 J5.5
  Top 0.406: 10.79,33.02 Q11.6